# EAGLE design board (EAGLE 9.6.2)
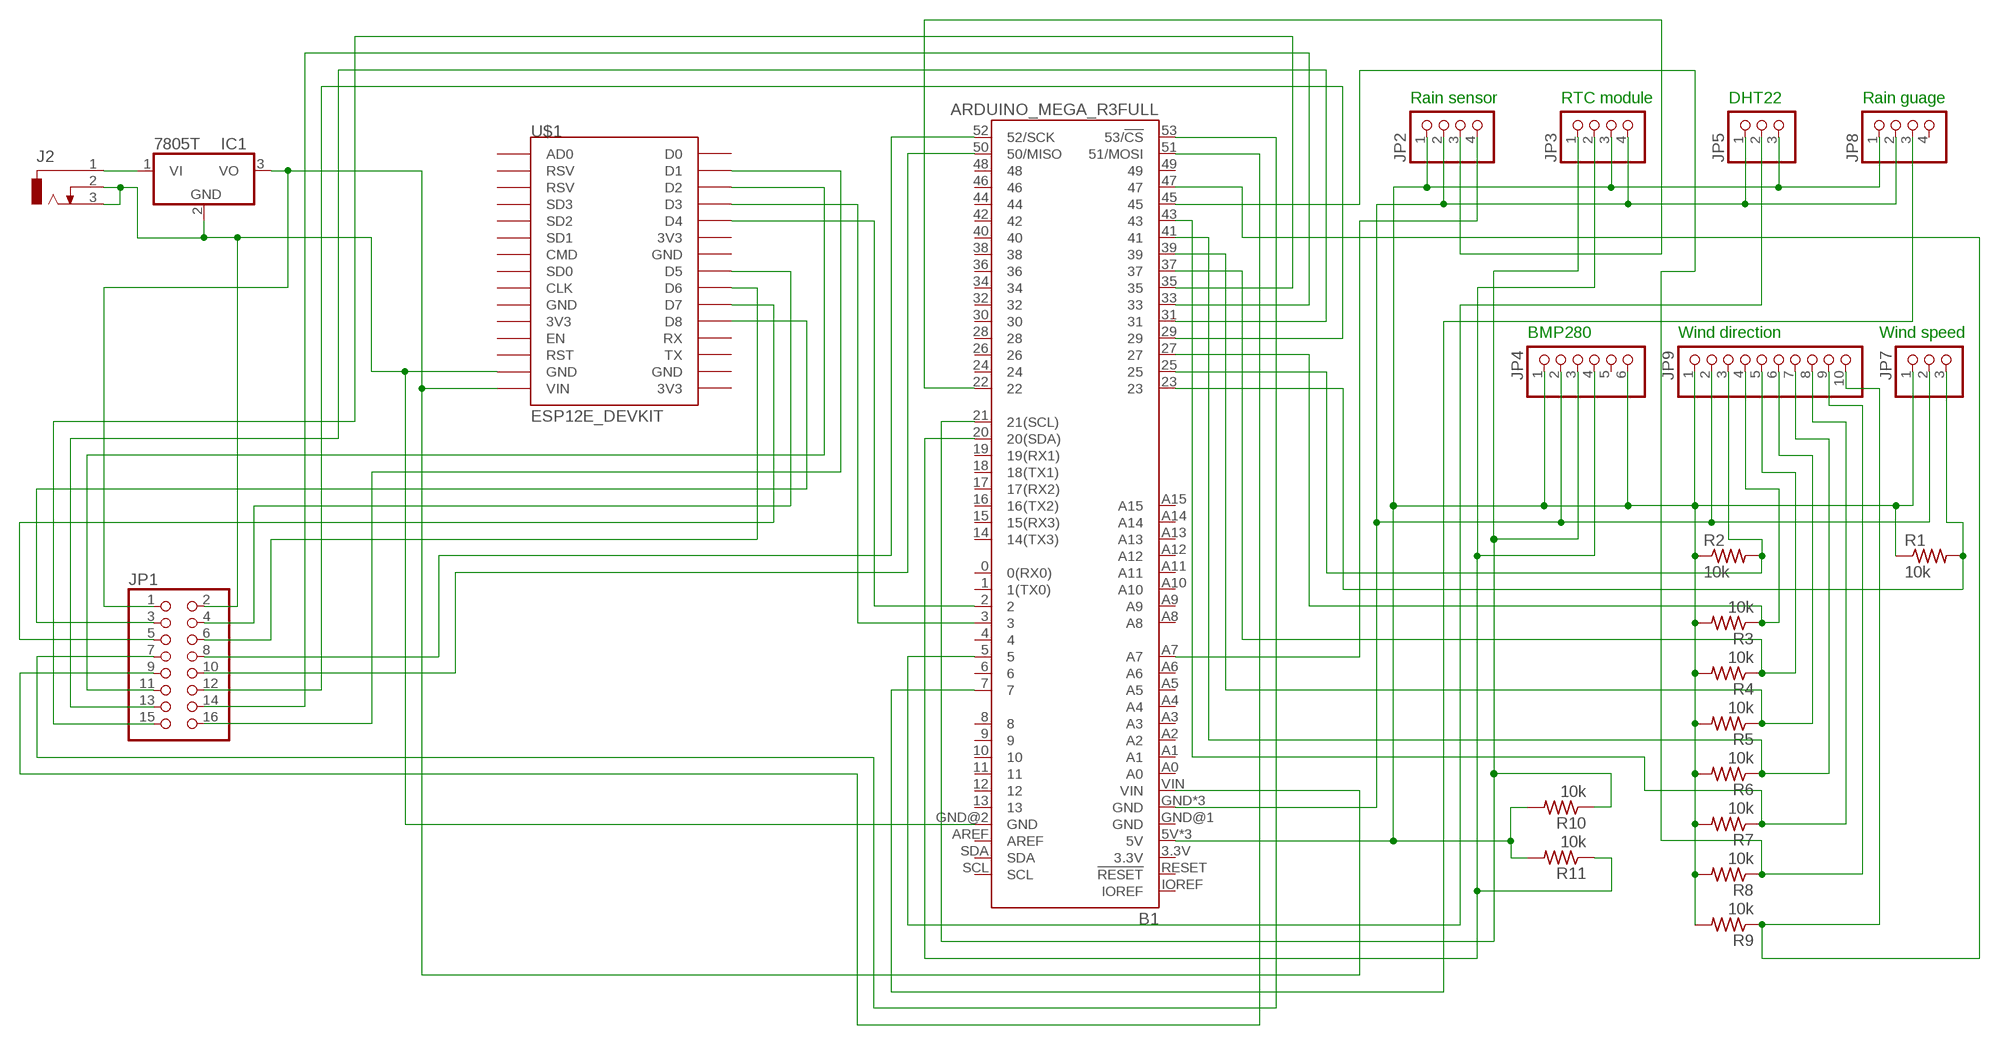
[diagram p0: schematic, sheet 1]

## Parts
B1  ARDUINO_MEGA_R3FULL  [ARDUINO_MEGA_NO_SILK]
IC1  7805T  [TO220H]
J2  DCJ0303  [DCJ0303]
JP1  PINHD-2X8/90  [2X08/90]
JP2  PINHD-1X4  [1X04]
JP3  PINHD-1X4  [1X04]
JP4  PINHD-1X6  [1X06]
JP5  PINHD-1X3  [1X03]
JP7  PINHD-1X3  [1X03]
JP8  PINHD-1X4  [1X04]
JP9  PINHD-1X10  [1X10]
R1  10k  R-US_0207/10  [0207/10]
R2  10k  R-US_0207/10  [0207/10]
R3  10k  R-US_0207/10  [0207/10]
R4  10k  R-US_0207/10  [0207/10]
R5  10k  R-US_0207/10  [0207/10]
R6  10k  R-US_0207/10  [0207/10]
R7  10k  R-US_0207/10  [0207/10]
R8  10k  R-US_0207/10  [0207/10]
R9  10k  R-US_0207/10  [0207/10]
R10  10k  R-US_0207/10  [0207/10]
R11  10k  R-US_0207/10  [0207/10]
U$1  ESP12E_DEVKIT  [ESP12E_DEVKIT]

## Nets
N$1: IC1.1(VI) J2.1
N$2: B1.GND@2(GND) IC1.2(GND) J2.2 J2.3 JP1.2 U$1.GND@1(GND)
N$3: B1.5V B1.5V@1(5V) B1.5V@2(5V) JP2.1 JP3.3 JP4.1 JP4.6 JP5.3 JP7.1 JP8.1 JP9.1 R1.1 R2.1 R3.2 R4.2 R5.2 R6.2 R7.2 R8.2 R9.2 R10.2 R11.2
N$4: B1.VIN IC1.3(VO) JP1.1 U$1.VIN
N$5: B1.23 JP7.3 R1.2
N$7: B1.GND B1.GND@3(GND) B1.GND@4(GND) JP2.2 JP3.4 JP4.2 JP5.1 JP7.2 JP8.2 JP9.2
N$8: B1.A7 JP2.4
N$9: B1.2 U$1.D4
N$10: B1.5 JP5.2
N$12: B1.7 JP8.3
N$13: B1.33 JP1.14
N$14: B1.3 U$1.D3
N$15: JP1.11 U$1.D2
N$16: B1.29 JP1.12
N$17: B1.31 JP1.13
N$18: B1.35 JP1.15
N$19: JP1.16 U$1.D1
N$20: JP1.6 U$1.D6
N$21: JP1.3 U$1.D8
N$22: JP1.4 U$1.D5
N$23: B1.53(53/!CS) JP1.7
N$24: JP1.5 U$1.D7
N$25: B1.52(52/SCK) JP1.8
N$26: B1.51(51/MOSI) JP1.9
N$27: B1.25 JP9.3 R2.2
N$28: B1.50(50/MISO) JP1.10
N$29: B1.27 JP9.4 R3.1
N$30: B1.37 JP9.5 R4.1
N$31: B1.39 JP9.6 R5.1
N$32: B1.41 JP9.7 R6.1
N$33: B1.43 JP9.8 R7.1
N$34: B1.45 JP9.9 R8.1
N$35: B1.47 JP9.10 R9.1
N$36: B1.22 JP2.3
N$91: B1.21(21(SCL)) JP3.1 JP4.3 R10.1
N$92: B1.20(20(SDA)) JP3.2 JP4.4 R11.1
Unconnected: B1.0(0(RX0)) B1.1(1(TX0)) B1.3.3V B1.4 B1.6 B1.8 B1.9 B1.10 B1.11 B1.12 B1.13 B1.14(14(TX3)) B1.15(15(RX3)) B1.16(16(TX2)) B1.17(17(RX2)) B1.18(18(TX1)) B1.19(19(RX1)) B1.24 B1.26 B1.28 B1.30 B1.32 B1.34 B1.36 B1.38 B1.40 B1.42 B1.44 B1.46 B1.48 B1.49 B1.A0 B1.A1 B1.A2 B1.A3 B1.A4 B1.A5 B1.A6 B1.A8 B1.A9 B1.A10 B1.A11 B1.A12 B1.A13 B1.A14 B1.A15 B1.AREF B1.GND@1(GND) B1.IOREF B1.RESET(!RESET) B1.SCL B1.SDA JP4.5 JP8.4 U$1.3V3@0(3V3) U$1.3V3@1(3V3) U$1.3V3@2(3V3) U$1.AD0 U$1.CLK U$1.CMD U$1.D0 U$1.EN U$1.GND@0(GND) U$1.GND@2(GND) U$1.GND@3(GND) U$1.RST U$1.RSV@0(RSV) U$1.RSV@1(RSV) U$1.RX U$1.SD0 U$1.SD1 U$1.SD2 U$1.SD3 U$1.TX

## Notes on the sheet
- Rain sensor | RTC module | DHT22 | Rain guage
- BMP280 | Wind direction | Wind speed

## Library data of the parts
B1 = SparkFun-Boards:ARDUINO_MEGA_R3: Arduino Mega R3 ATmega2560 R3 compatible footprint. SparkFun Products: Arduino Mega 2560 R3 <https://www.sparkfun.com/products/11061>
IC1 = adafruit:78*: Positive VOLTAGE REGULATOR Added bigger pads to the TO-92 package
J2 = con-jack:DCJ0303: DC POWER JACK Source: DCJ0303.pdf; OC_FARNELL: unknown; OC_NEWARK: unknown
JP1 = pinhead:PINHD-2X8: PIN HEADER
JP2 JP3 JP8 = pinhead:PINHD-1X4: PIN HEADER
JP4 = pinhead:PINHD-1X6: PIN HEADER
JP5 JP7 = pinhead:PINHD-1X3: PIN HEADER
JP9 = pinhead:PINHD-1X10: PIN HEADER
R1-R11 = rcl:R-US_: RESISTOR, American symbol; SPICEPREFIX: R
U$1 = ESP12E_DEVKIT:ESP12E_DEVKIT: ESP12E DEVKIT BOARD

## Board
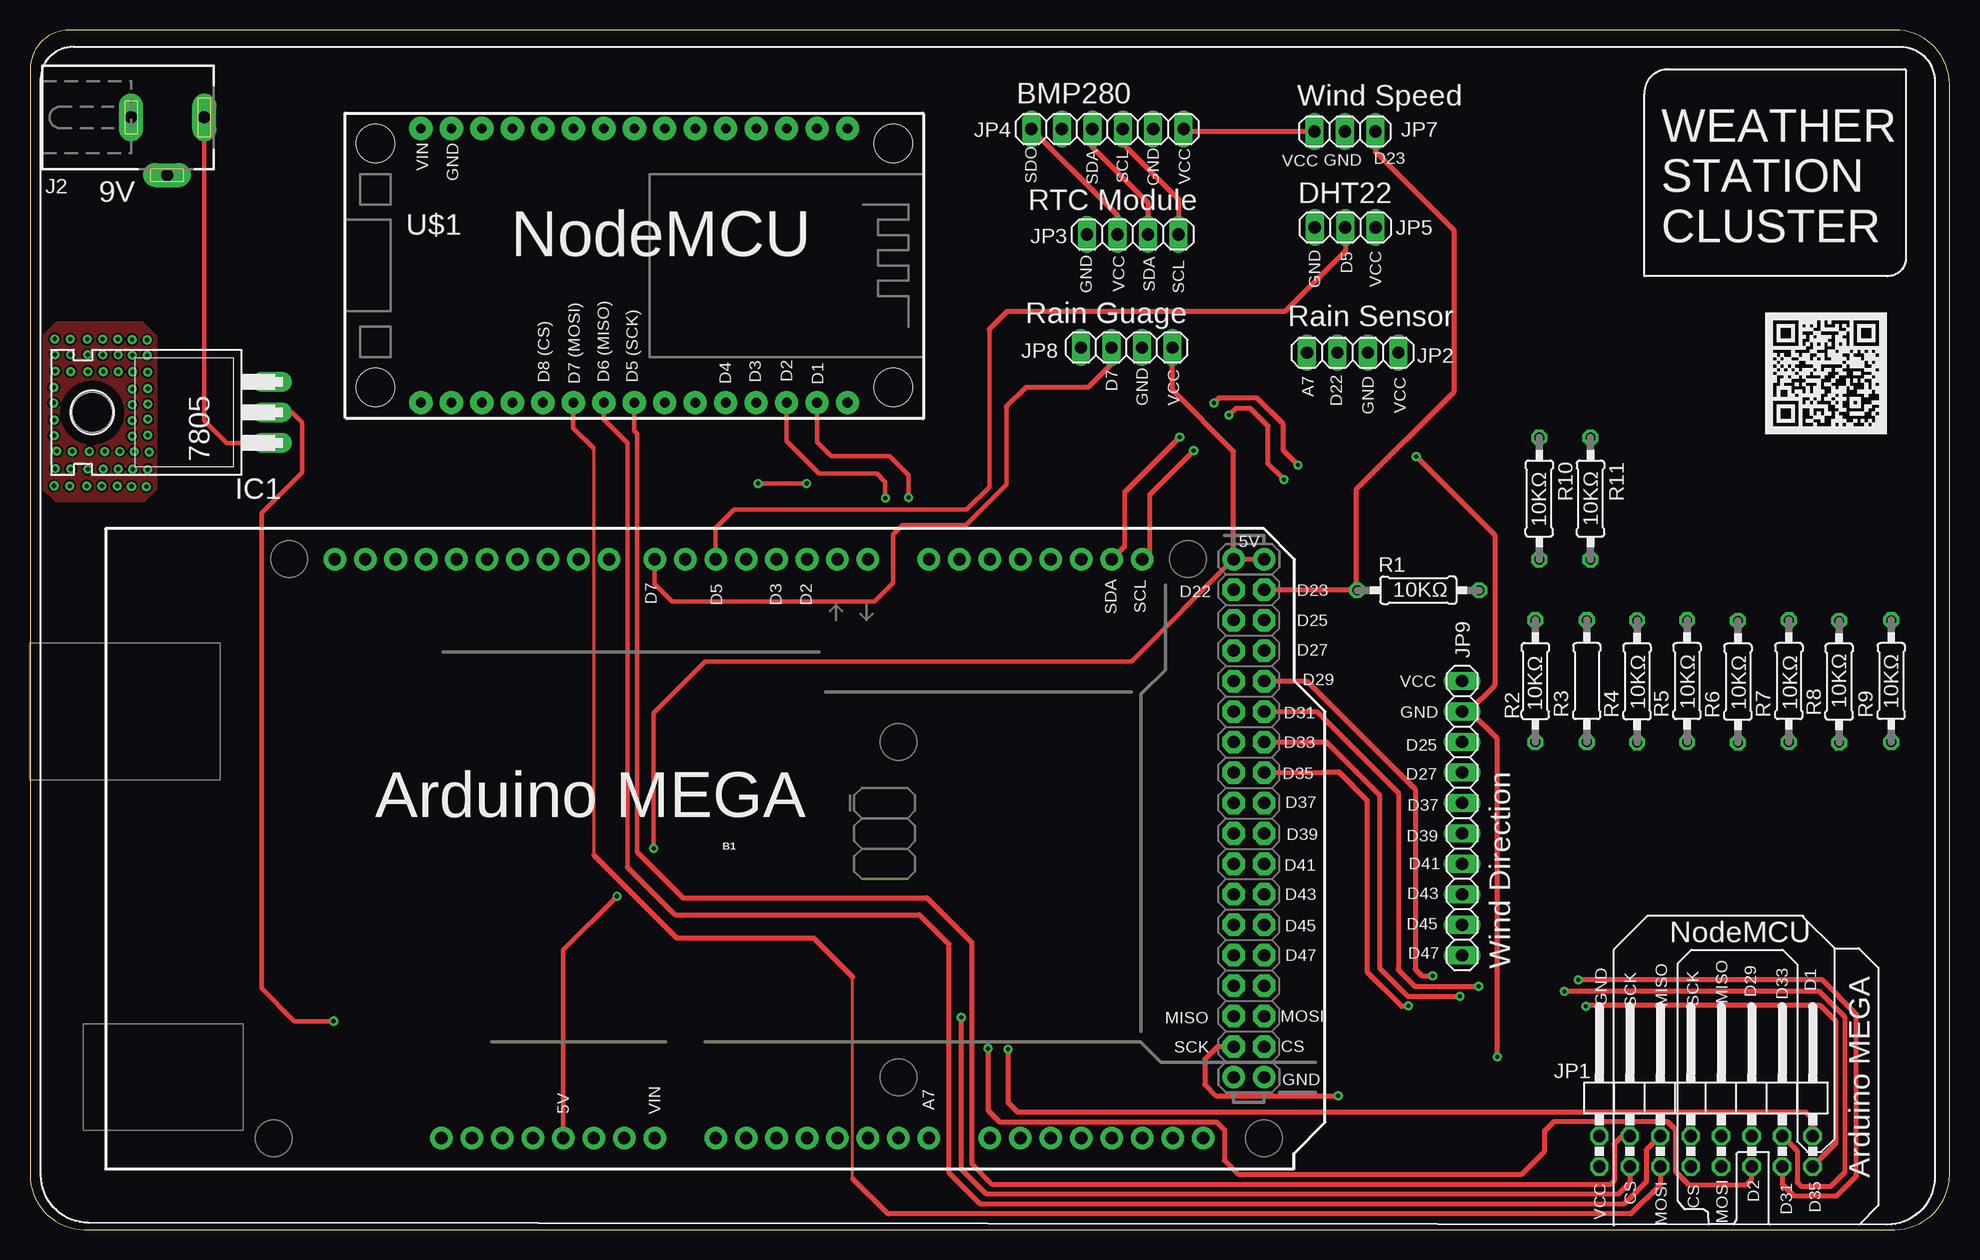
[diagram p1: board, top side]
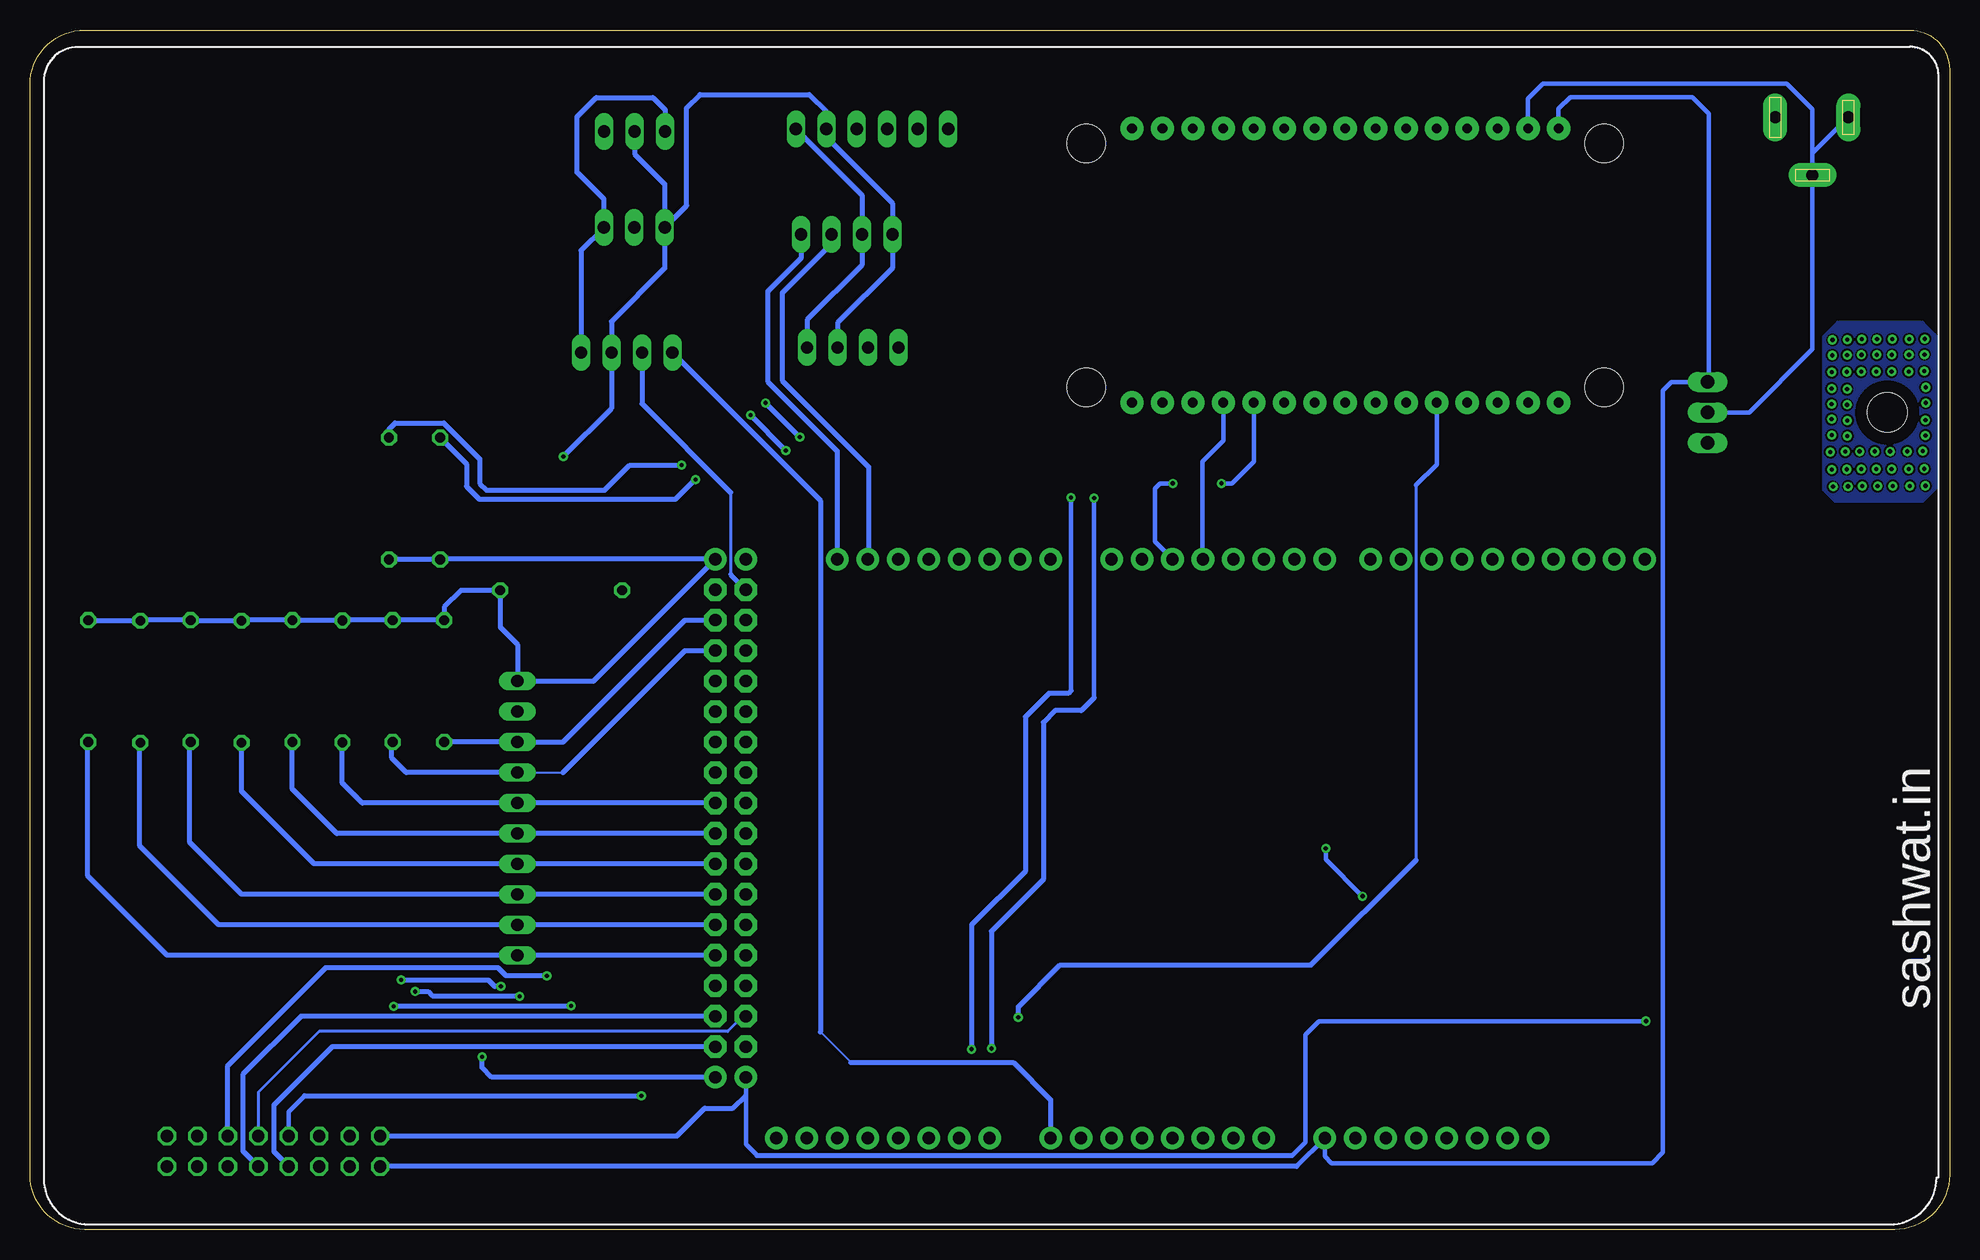
[diagram p2: board, bottom side, seen from below]

Size 160 x 100 mm. Coordinates in mm from the lower left corner, seen from the top.
Outline: 0,96.7 0,4.55 arc90 4.55,0 155.42,0 arc90 160,4.58 160,95.45 arc90 155.45,100 3.3,100 arc90 0,96.7
Copper layers (1*16): Top 0.035mm / dielectric 1.5mm / Bottom 0.035mm
Design rules "default": minimum track width 6mil, minimum drill 0.35mm, track to track 6mil, track to pad 6mil, pad to pad 6mil, via to via 6mil, smd to smd 6mil, copper to edge 40mil, drill to drill 6mil, minimum pad ring 10mil, minimum via ring 8mil, stop-mask expansion 4mil, vias tented up to drill 0mil, thermal gap 10mil

### Footprints (pad centres in the part's own frame; a part is rotated, then mirrored left to right if it is on the bottom)
ARDUINO_MEGA_NO_SILK = drill 1.016 pad 1.88: 0 13.97,24.13; 1 11.43,24.13; 2 8.89,24.13; 3 6.35,24.13; 3.3V -13.97,-24.13; 4 3.81,24.13; 5 1.27,24.13; 5V -11.43,-24.13; 5V@1 44.45,24.13; 5V@2 46.99,24.13; 6 -1.27,24.13; 7 -3.81,24.13; 8 -7.62,24.13; 9 -10.16,24.13; 10 -12.7,24.13; 11 -15.24,24.13; 12 -17.78,24.13; 13 -20.32,24.13; 14 19.05,24.13; 15 21.59,24.13; 16 24.13,24.13; 17 26.67,24.13; 18 29.21,24.13; 19 31.75,24.13; 20 34.29,24.13; 21 36.83,24.13; A0 1.27,-24.13; A1 3.81,-24.13; A2 6.35,-24.13; A3 8.89,-24.13; A4 11.43,-24.13; A5 13.97,-24.13; A6 16.51,-24.13; A7 19.05,-24.13; A8 24.13,-24.13; A9 26.67,-24.13; A10 29.21,-24.13; A11 31.75,-24.13; A12 34.29,-24.13; A13 36.83,-24.13; A14 39.37,-24.13; A15 41.91,-24.13; AREF -25.4,24.13; GND -8.89,-24.13; GND@1 -6.35,-24.13; GND@2 44.45,-19.05; GND@3 46.99,-19.05; GND@4 -22.86,24.13; IOREF -19.05,-24.13; NC -21.59,-24.13; RESET -16.51,-24.13; SCL -30.48,24.13; SDA -27.94,24.13; VIN -3.81,-24.13 | drill 1.016 pad 1.88 octagon: 22 44.45,21.59; 23 46.99,21.59; 24 44.45,19.05; 25 46.99,19.05; 26 44.45,16.51; 27 46.99,16.51; 28 44.45,13.97; 29 46.99,13.97; 30 44.45,11.43; 31 46.99,11.43; 32 44.45,8.89; 33 46.99,8.89; 34 44.45,6.35; 35 46.99,6.35; 36 44.45,3.81; 37 46.99,3.81; 38 44.45,1.27; 39 46.99,1.27; 40 44.45,-1.27; 41 46.99,-1.27; 42 44.45,-3.81; 43 46.99,-3.81; 44 44.45,-6.35; 45 46.99,-6.35; 46 44.45,-8.89; 47 46.99,-8.89; 48 44.45,-11.43; 49 46.99,-11.43; 50 44.45,-13.97; 51 46.99,-13.97; 52 44.45,-16.51; 53 46.99,-16.51
TO220H = drill 1.118 long: 1 -2.54,-10.16; 2 0,-10.16; 3 2.54,-10.16 | hole 3.302: 0,4.826
DCJ0303 = drill 1 pad 2 long: 1 0,3.1; 2 4.8,0; 3 0,-3
2X08/90 = drill 1.016 octagon: 1 -8.89,-6.35; 2 -8.89,-3.81; 3 -6.35,-6.35; 4 -6.35,-3.81; 5 -3.81,-6.35; 6 -3.81,-3.81; 7 -1.27,-6.35; 8 -1.27,-3.81; 9 1.27,-6.35; 10 1.27,-3.81; 11 3.81,-6.35; 12 3.81,-3.81; 13 6.35,-6.35; 14 6.35,-3.81; 15 8.89,-6.35; 16 8.89,-3.81
1X04 = drill 1.016 long: 1 -3.81,0; 2 -1.27,0; 3 1.27,0; 4 3.81,0
1X06 = drill 1.016 long: 1 -6.35,0; 2 -3.81,0; 3 -1.27,0; 4 1.27,0; 5 3.81,0; 6 6.35,0
1X03 = drill 1.016 long: 1 -2.54,0; 2 0,0; 3 2.54,0
1X10 = drill 1.016 long: 1 -11.43,0; 2 -8.89,0; 3 -6.35,0; 4 -3.81,0; 5 -1.27,0; 6 1.27,0; 7 3.81,0; 8 6.35,0; 9 8.89,0; 10 11.43,0
0207/10 = drill 0.813 octagon: 1 -5.08,0; 2 5.08,0
ESP12E_DEVKIT = drill 0.8 pad 1.93: 3V3@0 -11.43,-7.62; 3V3@1 11.43,5.08; 3V3@2 11.43,-17.78; AD0 -11.43,17.78; CLK -11.43,-2.54; CMD -11.43,2.54; D0 11.43,17.78; D1 11.43,15.24; D2 11.43,12.7; D3 11.43,10.16; D4 11.43,7.62; D5 11.43,0; D6 11.43,-2.54; D7 11.43,-5.08; D8 11.43,-7.62; EN -11.43,-10.16; GND@0 -11.43,-5.08; GND@1 -11.43,-15.24; GND@2 11.43,2.54; GND@3 11.43,-15.24; RST -11.43,-12.7; RSV@0 -11.43,15.24; RSV@1 -11.43,12.7; RX 11.43,-10.16; SD0 -11.43,0; SD1 -11.43,5.08; SD2 -11.43,7.62; SD3 -11.43,10.16; TX 11.43,-12.7; VIN -11.43,-17.78 | hole 3.2: -10.16,21.59; 10.16,21.59; 10.16,-21.59; -10.16,-21.59

### Placement (x,y rotation side)
B1  55.88,31.75 0 top
IC1  10.01,68.12 90 top
J2  11.43,92.71 270 top
JP1  139.7,11.61 0 top
JP2  110.26,73.1 180 top
JP3  91.92,82.96 180 top
JP4  89.81,91.74 180 top
JP5  109.63,83.54 0 top
JP7  109.6,91.54 0 top
JP8  91.41,73.53 180 top
JP9  119.38,34.29 270 top
R1  115.72,53.29 180 top
R2  125.48,45.72 270 top
R3  129.77,45.72 90 top
R4  133.96,45.69 90 top
R5  138.13,45.72 90 top
R6  142.37,45.67 90 top
R7  146.61,45.72 90 top
R8  150.8,45.67 90 top
R9  155.14,45.72 90 top
R10  125.81,60.93 270 top
R11  130.07,60.93 270 top
U$1  50.37,80.37 270 top

### Tracks (layer width: path | path; a pad name or v marks a point on that pad's centre or on a via)
GND
  pour Top: 1.07,61.79 1.07,74.48 2.24,75.64 9.35,75.64 10.52,74.47 10.52,61.67 9.52,60.68 2.18,60.68
  pour Bottom: 1.07,74.47 1.07,61.82 2.24,60.66 2.24,60.63 9.52,60.63 10.54,61.65 10.54,74.47 9.32,75.69 2.24,75.69 2.16,75.62 2.16,75.56
N$1
  Top 0.381: J2.1 14.53,67.44 16.38,65.58 IC1.1
N$2  (via drill 0.35)
  Top 0.152: 21.84,68.12 IC1.2
  Top 0.381: v25.3,17.37 22.02,17.37 19.3,20.09 19.3,59.71 22.68,63.09 22.68,67.28 21.84,68.12
  Bottom 0.381: J2.3 11.43,89.71 | 11.43,89.71 J2.2 11.43,73.38 16.69,68.12 IC1.2 | 11.43,89.71 11.43,93.4 13.56,95.53 33.88,95.53 35.13,94.28 U$1.GND@1 | B1.GND@2 100.33,11.2 100.33,7.09 99.42,6.17 | 54.79,6.17 53.7,7.26 53.7,16.23 52.55,17.37 v25.3,17.37
  Bottom 0.406: JP1.2 106.07,7.8 103.76,10.11 101.42,10.11 100.33,11.2 | 99.42,6.17 54.79,6.17
N$3  (via drill 0.35)
  Top 0.152: 96.37,91.54 JP4.1 | 48.95,27.79 v48.92,27.79
  Top 0.381: B1.5V@1 91.8,47.35 56.26,47.35 51.99,43.08 v51.99,31.77 | B1.5V 44.45,23.29 48.95,27.79
  Top 0.406: JP7.1 96.37,91.54 | JP4.6 90.65,84.56 JP3.3 | JP8.1 95.22,69.98 100.33,64.87 B1.5V@1 B1.5V@2
  Bottom 0.152: 133.93,50.8 R4.2 | 138.1,50.77 R5.2 | 142.32,50.8 R6.2 | 146.56,50.75 R7.2 | 150.75,50.8 R8.2 | 155.09,50.75 R9.2 | 119.35,45.74 JP9.1 | 125.78,55.88 R10.2
  Bottom 0.381: v51.99,31.77 51.99,30.86 v48.92,27.79
  Bottom 0.406: JP9.1 113.03,45.72 B1.5V@2 125.78,55.88 | 133.93,50.8 R3.2 R2.1 125.48,51.89 124.08,53.29 R1.1 120.8,50.22 119.35,48.77 119.35,45.74 | R4.2 138.1,50.77 | R5.2 142.32,50.8 | R6.2 146.56,50.75 | R7.2 150.75,50.8 | R8.2 155.09,50.75 | JP2.1 114.07,81.64 JP5.3 112.17,85.9 114.4,88.14 114.4,92.76 112.8,94.36 108.08,94.36 107.06,93.34 JP7.1 | JP4.1 90.65,86.23 JP3.3 90.65,80.42 95.22,75.84 JP8.1 | R10.2 R11.2
N$4
  Bottom 0.152: 20.07,70.76 IC1.3
  Bottom 0.381: 54.43,5.26 B1.VIN 52.07,6.1 51.51,5.54 24.79,5.54 23.9,6.43 23.9,69.95 23.19,70.66 IC1.3 | U$1.VIN 32.59,93.42 31.6,94.41 21.44,94.41 20.07,93.04 20.07,70.76
  Bottom 0.406: 54.43,5.26 JP1.1
N$5
  Top 0.152: 110.59,53.34 R1.2 110.54,53.39
  Top 0.406: B1.23 110.59,53.34 | JP7.3 112.14,89.84 118.67,83.31 118.67,69.83 110.54,61.7 110.54,53.39
N$7  (via drill 0.35)
  Top 0.152: v122.3,14.4 122.28,14.43 | 120.04,43.18 JP9.2 119.91,43.18
  Top 0.406: v115.54,64.44 122.1,57.89 122.1,45.36 119.91,43.18 | v122.3,14.4 122.3,40.92 120.04,43.18
  Bottom 0.152: 93.62,93.22 JP4.2 93.62,91.06 | 122.33,14.38 v122.3,14.4
  Bottom 0.406: JP7.2 109.6,89.66 107.09,87.15 JP5.1 | JP5.1 107.09,80.14 111.53,75.69 JP2.2 111.53,68.45 v115.54,64.44 | JP5.1 105.26,85.37 105.26,93.52 104.17,94.61 95.02,94.61 93.62,93.22 | 93.62,91.06 88.11,85.55 JP3.4 88.11,80.16 92.68,75.59 JP8.2 | 122.33,14.38 122.33,13.51 121.51,12.7 B1.GND@3
N$8
  Bottom 0.152: 94.11,16.46 91.57,13.92
  Bottom 0.406: JP2.4 94.11,60.76 94.11,16.46 | 91.57,13.92 78.03,13.92 74.93,10.82 B1.A7
N$9  (via drill 0.35)
  Top 0.381: v60.68,62.2 v64.74,62.2
  Bottom 0.381: U$1.D4 57.99,64.03 59.82,62.2 v60.68,62.2 | v64.74,62.2 65.81,62.2 66.24,61.77 66.24,57.35 B1.2
N$10
  Top 0.381: 79.96,75.06 79.96,61.9 78.08,60.02 58.7,60.02 57.15,58.47 B1.5
  Top 0.406: JP5.2 109.63,81.56 104.6,76.53 81.43,76.53 79.96,75.06
N$12
  Top 0.152: 71.92,53.91 71.93,53.9
  Top 0.381: 81.39,68.59 81.39,62.12 78,58.73 72.72,58.73 71.92,57.92 71.92,53.91 | B1.7 52.07,53.82 53.52,52.38 70.41,52.38 71.93,53.9
  Top 0.406: JP8.3 90.14,72.16 88.19,70.21 83.01,70.21 81.39,68.59
N$13  (via drill 0.35)
  Top 0.406: B1.33 108.08,40.64 112.5,36.22 112.5,21.79 114.86,19.43 v119.18,19.43 | JP1.14 147.29,6.55 147.29,3.94 147.63,3.61 150.11,3.61 151.31,4.8 151.31,17.68 149.15,19.84 v127.89,19.84
  Bottom 0.406: v127.89,19.84 126.82,19.84 126.47,19.48 119.23,19.48 v119.18,19.43
N$14
  Bottom 0.152: 62.26,55.91 B1.3
  Bottom 0.381: U$1.D3 60.53,65.76 62.26,64.03 62.26,55.91
N$15  (via drill 0.35)
  Top 0.152: 71.27,61.01 v71.3,60.98
  Top 0.381: U$1.D2 63.07,65.71 65.76,63.02 70.59,63.02 71.27,62.33 71.27,61.01
  Top 0.406: v79.86,15.09 79.86,9.93 80.82,8.97 98.91,8.97 99.54,8.33 99.54,5.77 100.69,4.62 124.36,4.62 126.26,6.53 126.26,8.23 127.05,9.02 136.5,9.02 137.16,8.36 137.16,4.85 138.28,3.73 143.05,3.73 143.51,4.19 JP1.11
  Bottom 0.381: v71.3,60.98 71.3,44.32
  Bottom 0.406: 71.3,44.32 72.36,43.26 74.57,43.26 75.54,42.29 75.54,29.18 79.86,24.87 v79.86,15.09
N$16  (via drill 0.35)
  Top 0.406: B1.29 106.43,45.72 115.47,36.68 115.47,21.69 116,21.16 v116.92,21.16
  Bottom 0.152: 130.11,21.83 130.12,21.82
  Bottom 0.406: JP1.12 143.51,13.67 135.36,21.82 130.12,21.82 | v116.92,21.16 120.32,21.16 120.99,21.83 130.11,21.83
N$17  (via drill 0.35)
  Top 0.406: B1.31 107.26,43.18 114.05,36.4 114.05,21.67 115.44,20.27 v120.75,20.27 | JP1.13 146.05,3.79 147.04,2.79 150.6,2.79 152.25,4.44 152.25,17.96 149.4,20.8 v129.06,20.8
  Bottom 0.406: v129.06,20.8 121.79,20.8 121.26,20.27 v120.75,20.27
N$18  (via drill 0.35)
  Top 0.152: 107.82,38.1 107.87,38.15 | 129.77,18.67 v129.69,18.59
  Top 0.406: B1.35 107.82,38.1 | 107.87,38.15 109.09,38.15 111.46,35.79 111.46,21.49 114.35,18.59 114.88,18.59 v114.88,18.64 | JP1.15 150.55,7.21 150.55,17.35 149.23,18.67 129.77,18.67
  Bottom 0.406: v129.69,18.59 129.64,18.64 v114.88,18.64
N$19  (via drill 0.35)
  Top 0.152: 148.59,9.17 148.62,9.2
  Top 0.381: U$1.D1 65.61,65.66 66.78,64.49 71.63,64.49 73.23,62.89 v73.23,61.01
  Top 0.406: v81.51,15.04 81.51,10.59 82.3,9.8 148.01,9.8 148.62,9.2 | JP1.16 148.59,9.17
  Bottom 0.381: v73.23,61.01 73.23,44.93
  Bottom 0.406: 73.23,44.93 73.46,44.7 75.08,44.7 77.04,42.75 77.04,29.87 81.51,25.4 v81.51,15.04
N$20
  Top 0.381: U$1.D6 47.83,67.56 49.81,65.58 49.81,30.2
  Top 0.406: JP1.6 134.72,6.63 134.72,3.99 132.84,2.11 79.25,2.11 76.61,4.75 76.61,23.77 74.14,26.24 53.77,26.24 49.81,30.2
N$21  (via drill 0.35)
  Top 0.406: JP1.3 133.35,3.91 132.39,2.95 79.73,2.95 77.62,5.05 v77.62,17.68
  Bottom 0.152: 53.21,22.05 53.24,22.02
  Bottom 0.254: 44.48,62.05 44.48,30.78
  Bottom 0.381: U$1.D8 42.75,63.78 44.48,62.05
  Bottom 0.406: 44.48,30.78 53.21,22.05 74.14,22.05 77.62,18.57 v77.62,17.68
N$22
  Top 0.381: U$1.D5 50.37,66.6 50.62,66.34 50.62,31.47
  Top 0.406: JP1.4 132.72,7.8 132.05,7.14 132.05,4.06 131.72,3.73 80.24,3.73 78.51,5.46 78.51,23.9 74.75,27.66 54.43,27.66 50.62,31.47
N$23
  Bottom 0.406: B1.53 134.8,15.24 139.67,10.36 139.67,6.5 JP1.7
N$24
  Top 0.254: 68.58,4.24 68.58,21.06 | 46.99,65.13 46.99,31.22
  Top 0.381: U$1.D7 45.29,66.83 46.99,65.13
  Top 0.406: JP1.5 135.89,3.73 133.45,1.3 71.53,1.3 68.58,4.24 | 68.58,21.06 65.33,24.31 53.9,24.31 46.99,31.22
N$25  (via drill 0.35)
  Top 0.406: B1.52 98.96,15.24 97.92,14.2 97.92,12.07 98.83,11.15 v109.04,11.15
  Bottom 0.381: JP1.8 138.43,9.83 137.11,11.15
  Bottom 0.406: 137.11,11.15 v109.04,11.15
N$26
  Bottom 0.406: B1.51 137.41,17.78 142.27,12.93 142.27,6.55 JP1.9
N$27
  Bottom 0.406: B1.25 105.41,50.8 115.57,40.64 JP9.3 R2.2
N$28
  Bottom 0.152: B1.50 100.58,17.78
  Bottom 0.254: 100.58,17.78 101.85,16.51 135.92,16.51 140.97,11.46 JP1.10
N$29
  Bottom 0.152: JP9.4 115.57,38.1 | 129.85,40.56 R3.1
  Bottom 0.406: 115.57,38.1 105.41,48.26 B1.27 | JP9.4 128.63,38.1 129.85,39.32 129.85,40.56
N$30
  Bottom 0.406: B1.37 JP9.5 132.31,35.56 133.96,37.21 R4.1
N$31
  Bottom 0.406: B1.39 JP9.6 134.42,33.02 138.13,36.73 R5.1
N$32
  Bottom 0.406: B1.41 JP9.7 136.32,30.48 142.37,36.52 R6.1
N$33
  Bottom 0.152: 146.69,40.56 R7.1
  Bottom 0.406: B1.43 JP9.8 142.37,27.94 146.69,32.26 146.69,40.56
N$34
  Bottom 0.152: 150.85,40.54 R8.1
  Bottom 0.406: B1.45 JP9.9 144.27,25.4 150.85,31.98 150.85,40.54
N$35
  Bottom 0.152: 155.17,40.62 R9.1
  Bottom 0.406: B1.47 JP9.10 148.56,22.86 155.17,29.46 155.17,40.62
N$36
  Bottom 0.254: 101.6,61.44 101.6,54.61
  Bottom 0.406: JP2.3 108.99,68.83 101.6,61.44 | 101.6,54.61 B1.22
N$37  (via drill 0.35)
  other vias: 2.06,74.24
N$38  (via drill 0.35)
  other vias: 3.35,74.22
N$39  (via drill 0.35)
  other vias: 4.78,74.22
N$40  (via drill 0.35)
  other vias: 6.05,74.22
N$41  (via drill 0.35)
  other vias: 7.32,74.22
N$42  (via drill 0.35)
  other vias: 8.51,74.19
N$43  (via drill 0.35)
  other vias: 9.75,74.17
N$44  (via drill 0.35)
  other vias: 2.08,72.95
N$45  (via drill 0.35)
  other vias: 3.38,72.92
N$46  (via drill 0.35)
  other vias: 4.8,72.92
N$47  (via drill 0.35)
  other vias: 6.07,72.92
N$48  (via drill 0.35)
  other vias: 7.34,72.92
N$49  (via drill 0.35)
  other vias: 8.53,72.9
N$50  (via drill 0.35)
  other vias: 9.78,72.87
N$51  (via drill 0.35)
  other vias: 2.24,64.9
N$52  (via drill 0.35)
  other vias: 3.53,64.87
N$53  (via drill 0.35)
  other vias: 4.95,64.87
N$54  (via drill 0.35)
  other vias: 6.22,64.87
N$55  (via drill 0.35)
  other vias: 7.49,64.87
N$56  (via drill 0.35)
  other vias: 8.69,64.85
N$57  (via drill 0.35)
  other vias: 9.93,64.82
N$58  (via drill 0.35)
  other vias: 2.11,63.42
N$59  (via drill 0.35)
  other vias: 3.4,63.4
N$60  (via drill 0.35)
  other vias: 4.83,63.4
N$61  (via drill 0.35)
  other vias: 6.1,63.4
N$62  (via drill 0.35)
  other vias: 7.37,63.4
N$63  (via drill 0.35)
  other vias: 8.56,63.37
N$64  (via drill 0.35)
  other vias: 9.8,63.35
N$65  (via drill 0.35)
  other vias: 2.01,62
N$66  (via drill 0.35)
  other vias: 3.3,61.98
N$67  (via drill 0.35)
  other vias: 4.72,61.98
N$68  (via drill 0.35)
  other vias: 5.99,61.98
N$69  (via drill 0.35)
  other vias: 7.26,61.98
N$70  (via drill 0.35)
  other vias: 8.46,61.95
N$71  (via drill 0.35)
  other vias: 9.7,61.93
N$72  (via drill 0.35)
  other vias: 2.11,71.55
N$73  (via drill 0.35)
  other vias: 3.4,71.53
N$74  (via drill 0.35)
  other vias: 4.83,71.53
N$75  (via drill 0.35)
  other vias: 6.1,71.53
N$76  (via drill 0.35)
  other vias: 7.37,71.53
N$77  (via drill 0.35)
  other vias: 8.56,71.5
N$78  (via drill 0.35)
  other vias: 9.8,71.48
N$79  (via drill 0.35)
  other vias: 9.83,70.1
N$80  (via drill 0.35)
  other vias: 9.83,68.81
N$81  (via drill 0.35)
  other vias: 9.83,67.56
N$82  (via drill 0.35)
  other vias: 9.8,66.22
N$83  (via drill 0.35)
  other vias: 8.53,70.05
N$84  (via drill 0.35)
  other vias: 8.53,68.76
N$85  (via drill 0.35)
  other vias: 8.51,67.44
N$86  (via drill 0.35)
  other vias: 8.51,66.14
N$87  (via drill 0.35)
  other vias: 1.98,70.21
N$88  (via drill 0.35)
  other vias: 1.98,68.91
N$89  (via drill 0.35)
  other vias: 2.01,67.49
N$90  (via drill 0.35)
  other vias: 2.01,66.19
N$91  (via drill 0.35)
  Top 0.152: JP4.3 91.08,90.53
  Top 0.406: JP3.1 95.73,85.88 91.08,90.53 | v104.52,62.51 103.2,63.83 103.2,66.98 101.73,68.45 100.51,68.45 v99.95,67.89 | B1.21 93.35,56.52 93.35,61.29 v97,64.95
  Bottom 0.152: 104.57,62.51 v104.52,62.51
  Bottom 0.406: JP3.1 95.73,80.97 98.5,78.21 98.5,70.69 92.71,64.9 B1.21 | R10.1 123.62,63.83 123.62,61.95 122.56,60.88 106.2,60.88 104.57,62.51 | v97,64.95 v99.95,67.89
N$92  (via drill 0.35)
  Top 0.152: JP4.4 88.54,90.25
  Top 0.406: JP3.2 93.19,85.6 88.54,90.25 | B1.20 91.26,56.97 91.26,61.49 v95.83,66.06 | v105.69,63.73 104.47,64.95 104.47,67.13 102.29,69.32 99.09,69.32 v98.68,68.91
  Bottom 0.152: 90.09,55.96 B1.20
  Bottom 0.406: JP3.2 93.19,82.19 97.31,78.08 97.31,70.79 90.09,63.58 90.09,55.96 | R11.1 130.07,66.73 129.57,67.23 125.5,67.23 122.5,64.24 122.5,62.2 121.95,61.65 112.09,61.65 110.01,63.73 v105.69,63.73 | v98.68,68.91 v95.83,66.06

### Text on the board
tPlace: BMP280 | Wind Speed | VCC | GND | D23 | VIN | 9V | GND | SDO | SDA | SCL | GND | VCC | NodeMCU | RTC Module | DHT22 | WEATHER / STATION / CLUSTER | D5 | GND | VCC | SDA | SCL | GND | VCC | Rain Sensor | Rain Guage | D8 (CS) | D6 (MISO) | D5 (SCK) | D3 | D2 | D7 (MOSI) | D4 | D1 | D7 | GND | VCC | A7 | D22 | GND | VCC | 7805 | 10KΩ | 10KΩ | 5V | D22 | D23 | 10KΩ | D7 | D5 | D3 | D2 | SDA | SCL | D25 | D27 | D29 | VCC | D31 | GND | 10KΩ | 10KΩ | 10KΩ | 10KΩ | 10KΩ | 10KΩ | 10KΩ | D33 | D25 | Arduino MEGA | D35 | D27 | D37 | D37 | D39 | D39 | D41 | D41 | D43 | D43 | D45 | D45 | NodeMCU | D47 | D47 | Wind Direction | GND | MISO | MISO | D29 | D33 | SCK | SCK | D1 | MISO | MOSI | SCK | CS | GND | 5V | VIN | A7 | VCC | CS | MOSI | CS | MOSI | D31 | D35 | Arduino MEGA | D2
bPlace: sashwat.in